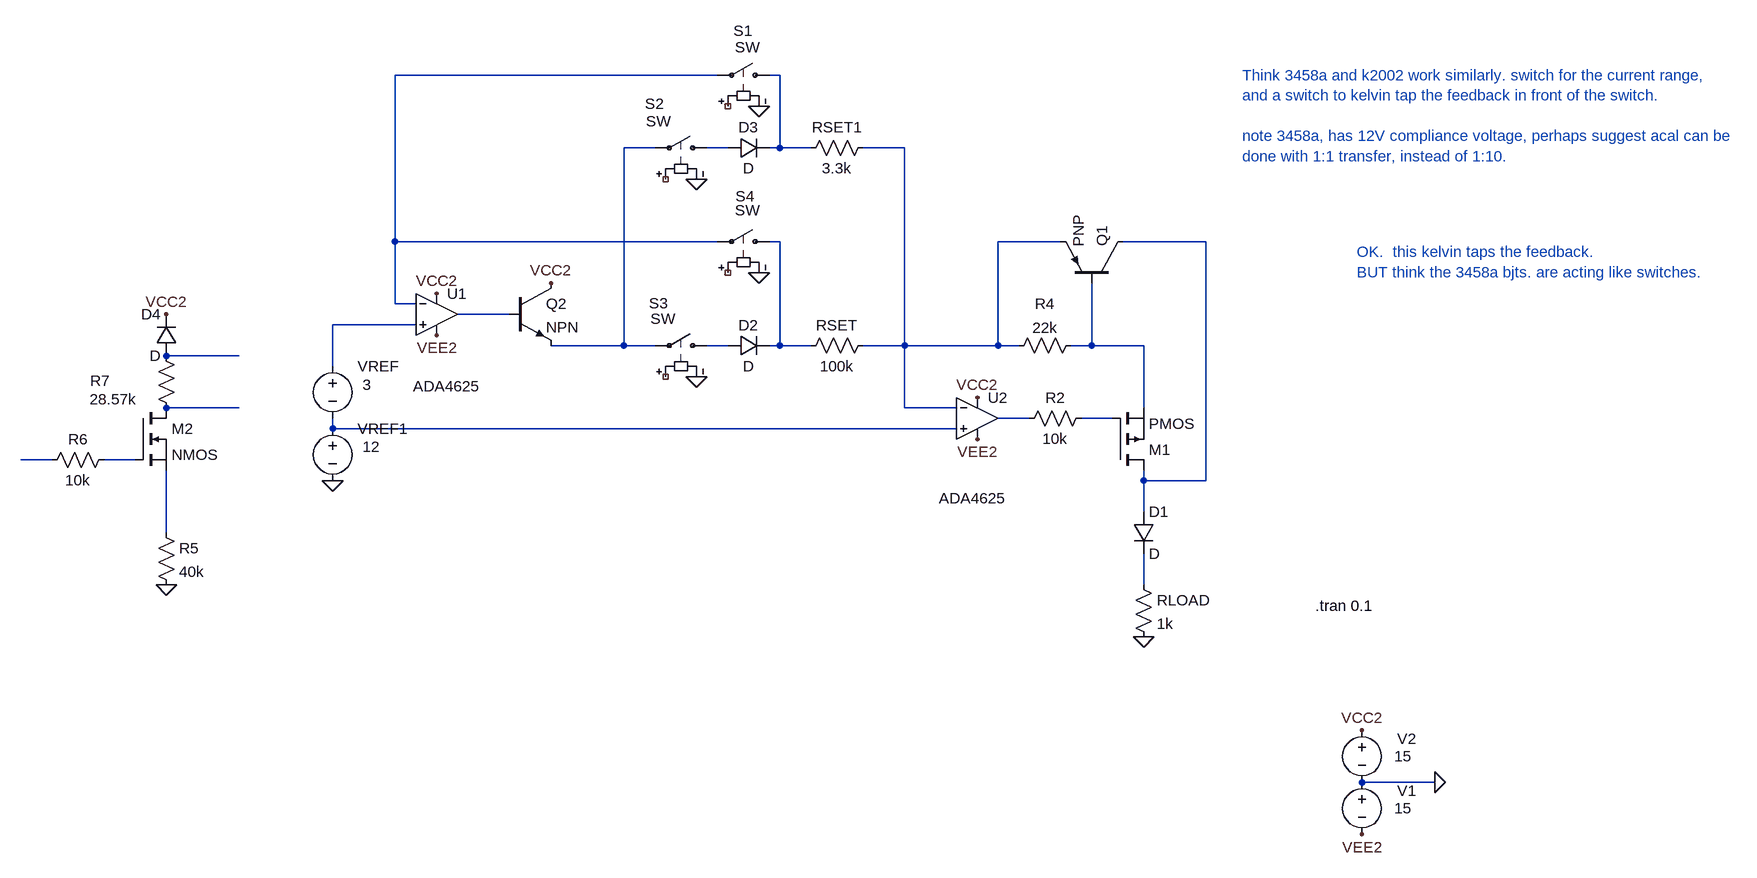
[diagram p0: schematic Draft19.asc]
Draft19.asc, the LTspice schematic file:
Version 4
SHEET 1 1768 872
WIRE 16 -400 -480 -400
WIRE 112 -400 96 -400
WIRE -80 -288 -128 -288
WIRE 32 -288 0 -288
WIRE 112 -288 112 -400
WIRE 112 -288 96 -288
WIRE 160 -288 112 -288
WIRE 304 -288 240 -288
WIRE -480 -144 -480 -400
WIRE 16 -144 -480 -144
WIRE 112 -144 96 -144
WIRE 544 -144 448 -144
WIRE 768 -144 640 -144
WIRE -480 -48 -480 -144
WIRE -448 -48 -480 -48
WIRE -304 -32 -384 -32
WIRE -448 -16 -576 -16
WIRE -128 16 -128 -288
WIRE -128 16 -240 16
WIRE -80 16 -128 16
WIRE 32 16 0 16
WIRE 112 16 112 -144
WIRE 112 16 96 16
WIRE 160 16 112 16
WIRE 304 16 304 -288
WIRE 304 16 240 16
WIRE 448 16 448 -144
WIRE 448 16 304 16
WIRE 480 16 448 16
WIRE 592 16 592 -80
WIRE 592 16 560 16
WIRE 672 16 592 16
WIRE -720 32 -832 32
WIRE -576 48 -576 -16
WIRE -720 112 -832 112
WIRE 304 112 304 16
WIRE 384 112 304 112
WIRE 672 112 672 16
WIRE -832 128 -832 112
WIRE 496 128 448 128
WIRE 624 128 576 128
WIRE -576 144 -576 128
WIRE 384 144 -576 144
WIRE -1008 192 -1056 192
WIRE -880 192 -928 192
WIRE 672 224 672 208
WIRE 768 224 768 -144
WIRE 768 224 672 224
WIRE 672 272 672 224
WIRE -832 304 -832 208
WIRE 672 384 672 336
WIRE 1120 688 1008 688
FLAG 1120 688 0
FLAG 1008 768 VEE2
FLAG 1008 608 VCC2
FLAG 416 160 VEE2
FLAG 416 96 VCC2
FLAG -416 0 VEE2
FLAG -416 -64 VCC2
FLAG -576 224 0
FLAG -832 384 0
FLAG 672 464 0
FLAG -832 -32 VCC2
FLAG -16 64 0
FLAG -16 -240 0
FLAG 80 -352 0
FLAG 80 -96 0
FLAG -240 -80 VCC2
SYMBOL voltage 1008 672 R0
WINDOW 0 54 29 Left 2
WINDOW 3 50 56 Left 2
WINDOW 123 0 0 Left 0
WINDOW 39 0 0 Left 0
SYMATTR InstName V1
SYMATTR Value 15
SYMBOL res 656 368 R0
SYMATTR InstName RLOAD
SYMATTR Value 1k
SYMBOL res 256 0 R90
WINDOW 0 0 56 VBottom 2
WINDOW 3 32 56 VTop 2
SYMATTR InstName RSET
SYMATTR Value 100k
SYMBOL pmos 624 208 M180
SYMATTR InstName M1
SYMBOL voltage 1008 592 R0
WINDOW 0 54 29 Left 2
WINDOW 3 50 56 Left 2
WINDOW 123 0 0 Left 0
WINDOW 39 0 0 Left 0
SYMATTR InstName V2
SYMATTR Value 15
SYMBOL res 592 112 R90
WINDOW 0 0 56 VBottom 2
WINDOW 3 32 56 VTop 2
SYMATTR InstName R2
SYMATTR Value 10k
SYMBOL res 576 0 R90
WINDOW 0 -33 56 VBottom 2
WINDOW 3 -27 56 VTop 2
SYMATTR InstName R4
SYMATTR Value 22k
SYMBOL pnp 640 -80 M270
SYMATTR InstName Q1
SYMBOL OpAmps\\ADA4625 416 64 R0
WINDOW 3 -59 187 Left 2
SYMATTR InstName U2
SYMBOL diode 656 272 R0
SYMATTR InstName D1
SYMBOL res -848 288 R0
SYMATTR InstName R5
SYMATTR Value 40k
SYMBOL res -912 176 R90
WINDOW 0 0 56 VBottom 2
WINDOW 3 32 56 VTop 2
SYMATTR InstName R6
SYMATTR Value 10k
SYMBOL OpAmps\\ADA4625 -416 -96 R0
WINDOW 3 -36 175 Left 2
SYMATTR InstName U1
SYMBOL voltage -576 32 R0
WINDOW 123 0 0 Left 0
WINDOW 39 0 0 Left 0
WINDOW 3 46 44 Left 2
WINDOW 0 38 16 Left 2
SYMATTR Value 3
SYMATTR InstName VREF
SYMBOL res -848 16 R0
WINDOW 0 -101 54 Left 2
WINDOW 3 -102 83 Left 2
SYMATTR InstName R7
SYMATTR Value 28.57k
SYMBOL nmos -880 112 R0
SYMATTR InstName M2
SYMBOL diode 32 32 R270
WINDOW 0 32 32 VTop 2
WINDOW 3 0 32 VBottom 2
SYMATTR InstName D2
SYMBOL res 256 -304 R90
WINDOW 0 0 56 VBottom 2
WINDOW 3 32 56 VTop 2
SYMATTR InstName RSET1
SYMATTR Value 3.3k
SYMBOL diode 32 -272 R270
WINDOW 0 32 32 VTop 2
WINDOW 3 0 32 VBottom 2
SYMATTR InstName D3
SYMBOL voltage -576 128 R0
WINDOW 123 0 0 Left 0
WINDOW 39 0 0 Left 0
WINDOW 3 46 44 Left 2
WINDOW 0 38 16 Left 2
SYMATTR Value 12
SYMATTR InstName VREF1
SYMBOL sw 112 -400 M270
WINDOW 0 68 71 VLeft 2
WINDOW 3 43 69 VLeft 2
SYMATTR InstName S1
SYMBOL sw 16 -288 M270
WINDOW 0 68 111 VLeft 2
WINDOW 3 41 110 VLeft 2
SYMATTR InstName S2
SYMBOL sw 16 16 M270
WINDOW 0 65 105 VLeft 2
WINDOW 3 41 103 VLeft 2
SYMATTR InstName S3
SYMBOL sw 112 -144 M270
WINDOW 0 70 68 VLeft 2
WINDOW 3 48 69 VLeft 2
SYMATTR InstName S4
SYMBOL diode -816 32 R180
WINDOW 0 24 64 Left 2
WINDOW 3 24 0 Left 2
SYMATTR InstName D4
SYMBOL npn -304 -80 R0
SYMATTR InstName Q2
TEXT 936 416 Left 2 !.tran 0.1
TEXT 1000 -128 Left 2 ;OK.  this kelvin taps the feedback.\nBUT think the 3458a bjts. are acting like switches.
TEXT 824 -400 Left 2 ;Think 3458a and k2002 work similarly. switch for the current range,\nand a switch to kelvin tap the feedback in front of the switch.\n \nnote 3458a, has 12V compliance voltage, perhaps suggest acal can be\ndone with 1:1 transfer, instead of 1:10.

The netlist it stands for:
* Draft19.asc
V1 0 VEE2 15
RLOAD N020 0 1k
RSET N005 N006 100k
M1 N007 N015 N011 N011 PMOS
V2 VCC2 0 15
R2 N015 N014 10k
R4 N011 N005 22k
Q1 N007 N011 N005 0 PNP
XU2 N016 N005 VCC2 VEE2 N014 ADA4625  ; pins In+ In- V+ V- OUT
D1 N007 N020 D
R5 N019 0 40k
R6 N018 N017 10k
XU1 N009 N001 VCC2 VEE2 N008 ADA4625  ; pins In+ In- V+ V- OUT
VREF N009 N016 3
R7 N012 N013 28.57k
M2 N013 N018 N019 N019 NMOS
D2 N010 N006 D
RSET1 N005 N002 3.3k
D3 N004 N002 D
VREF1 N016 0 12
S1 N002 N001 NC_01 0 SW
S2 N004 N003 NC_02 0 SW
S3 N010 N003 NC_03 0 SW
S4 N006 N001 NC_04 0 SW
D4 N012 VCC2 D
Q2 VCC2 N008 N003 0 NPN
.model D D
.lib standard.dio
.model NPN NPN
.model PNP PNP
.lib standard.bjt
.model NMOS NMOS
.model PMOS PMOS
.lib standard.mos
.tran 0.1
* OK.  this kelvin taps the feedback.
* BUT think the 3458a bjts. are acting like switches.
* Think 3458a and k2002 work similarly. switch for the current range,
* and a switch to kelvin tap the feedback in front of the switch.
* note 3458a, has 12V compliance voltage, perhaps suggest acal can be
* done with 1:1 transfer, instead of 1:10.
.backanno
.end